# Altium schematic sheet schematic_usb_multirs232.schdoc
size 274 x 231 mm
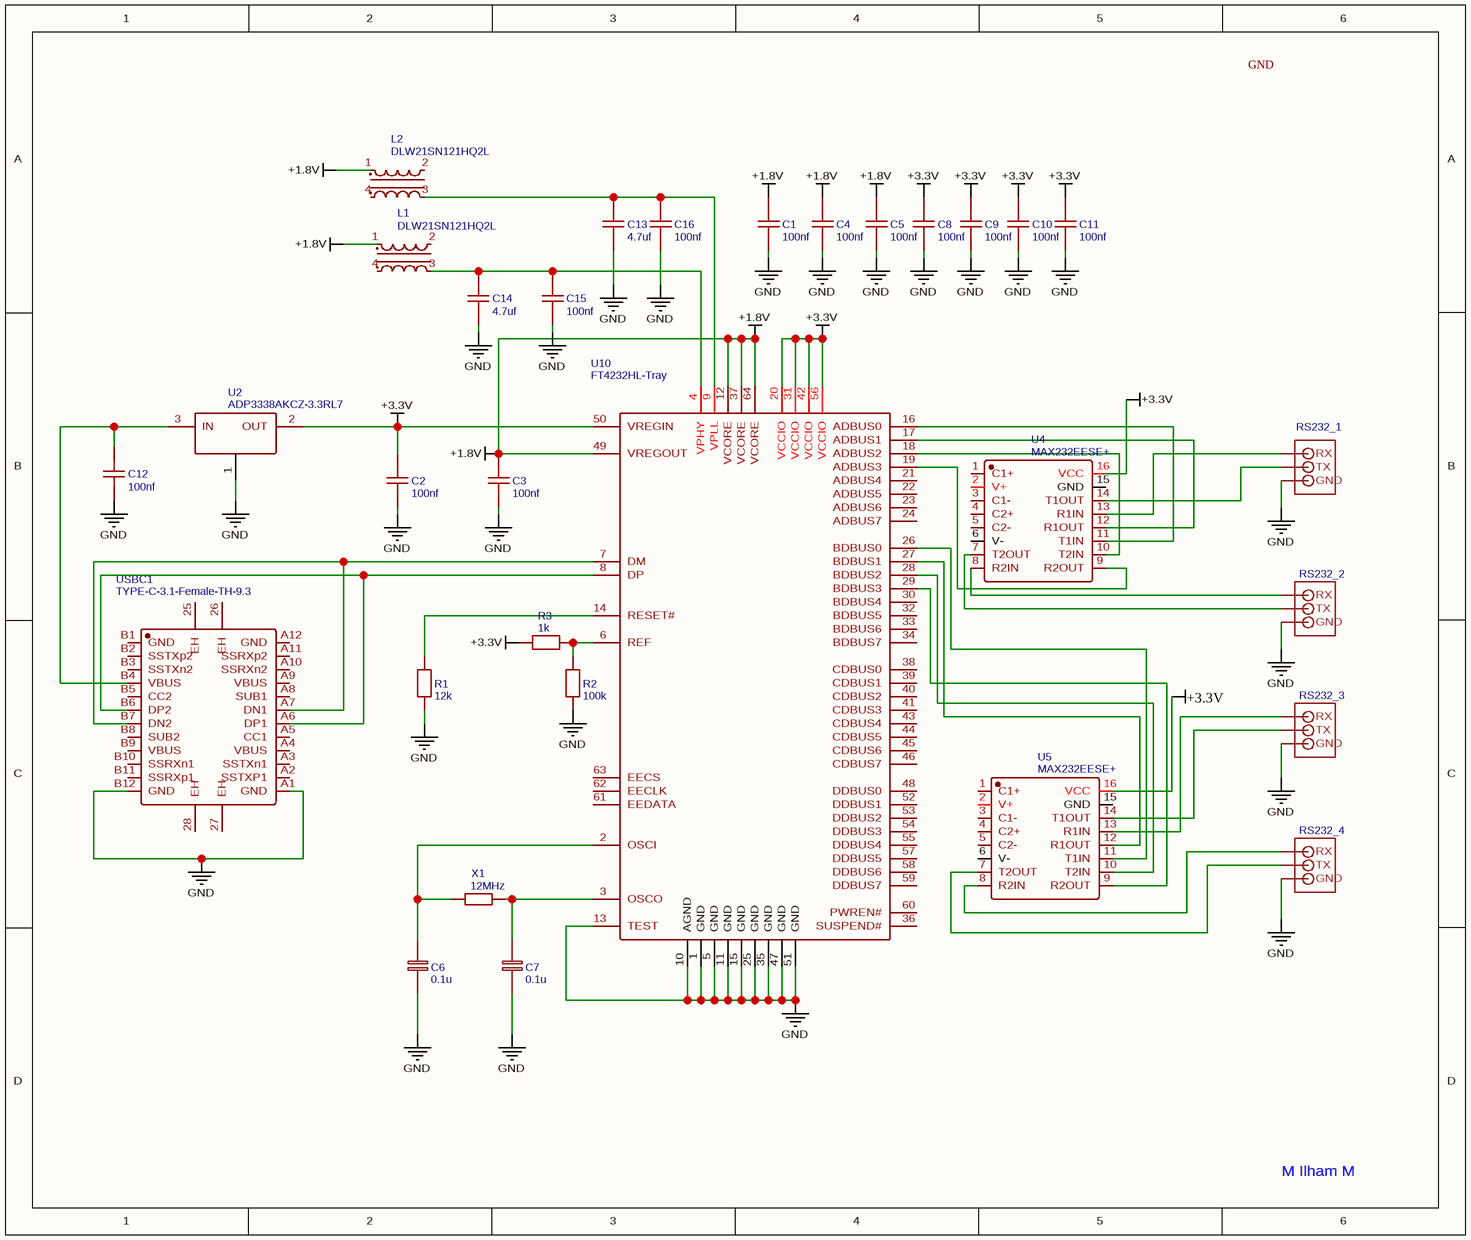
[diagram p0: schematic_usb_multirs232.schdoc]

## Parts
C1  100nf  [C0603]
C2  100nf  [C0603]
C3  100nf  [C0603]
C4  100nf  [C0603]
C5  100nf  [C0603]
C6  0.1u  [C0603]
C7  0.1u  [C0603]
C8  100nf  [C0603]
C9  100nf  [C0603]
C10  100nf  [C0603]
C11  100nf  [C0603]
C12  100nf  [C0603]
C13  4.7uf  [C0603]
C14  4.7uf  [C0603]
C15  100nf  [C0603]
C16  100nf  [C0603]
L1  DLW21SN121HQ2L  [FILTER-SMD_4P-L2.0-W1.2-BL_DLW21S]
L2  DLW21SN121HQ2L  [FILTER-SMD_4P-L2.0-W1.2-BL_DLW21S]
R1  12k  [R0603]
R2  100k  [R0603]
R3  1k  [R0603]
RS232_1  RX  [JST_B3B-PH_HEADER]  (value not drawn)
U2  ADP3338AKCZ-3.3RL7  [SOT-223]
U4  MAX232EESE+  [SO-16_L9.9-W3.9-P1.27-LS6.0-BL]
U5  MAX232EESE+  [SO-16_L9.9-W3.9-P1.27-LS6.0-BL]
U7  RS232_2  [JST_B3B-PH_HEADER]
U8  RS232_3  [JST_B3B-PH_HEADER]
U9  RS232_4  [JST_B3B-PH_HEADER]
U10  FT4232HL-Tray  [LQFP-64]
USBC1  TYPE-C-3.1-Female-TH-9.3  [USB-C-SMD_TYPE-C-3.1-FEMALE-TH-9.3]
X1  12MHz  [CRYSTAL-SMD_L11.1-W4.8-LS12.3]

## Nets
+1.8V: C1.1 C3.1 C4.1 C5.1 L1.1 L2.1 U5.16(VCC) U10.12(VCORE) U10.37(VCORE) U10.49(VREGOUT) U10.64(VCORE)
+3.3V: C2.1 C8.1 C9.1 C10.1 C11.1 R3.1 U2.2(OUT) U4.16(VCC) U10.20(VCCIO) U10.31(VCCIO) U10.42(VCCIO) U10.50(VREGIN) U10.56(VCCIO)
GND: C1.2 C2.2 C3.2 C4.2 C5.2 C6.2 C7.2 C8.2 C9.2 C10.2 C11.2 C12.2 C13.2 C14.2 C15.2 C16.2 R1.2 R2.2 RS232_1.P3(GND) U2.1(GND) U7.P3(GND) U8.P3(GND) U9.P3(GND) U10.1(GND) U10.5(GND) U10.10(AGND) U10.11(GND) U10.13(TEST) U10.15(GND) U10.25(GND) U10.35(GND) U10.47(GND) U10.51(GND) USBC1.A1(GND) USBC1.B12(GND)
NetC6_1: C6.1 U10.2(OSCI) X1.1
NetC7_1: C7.1 U10.3(OSCO) X1.2
NetC12_1: C12.1 U2.3(IN) USBC1.B4(VBUS)
NetC13_1: C13.1 C16.1 L2.3 U10.9(VPLL)
NetC14_1: C14.1 C15.1 L1.3 U10.4(VPHY)
NetR1_1: R1.1 U10.14(RESET#)
NetR2_1: R2.1 R3.2 U10.6(REF)
NetRS232_1_P1: RS232_1.P1(RX) U4.13(R1IN)
NetRS232_1_P2: RS232_1.P2(TX) U4.14(T1OUT)
NetU4_7: U4.7(T2OUT) U7.P2(TX)
NetU4_8: U4.8(R2IN) U7.P1(RX)
NetU4_9: U4.9(R2OUT) U10.19(ADBUS3)
NetU4_10: U4.10(T2IN) U10.18(ADBUS2)
NetU4_11: U4.11(T1IN) U10.16(ADBUS0)
NetU4_12: U4.12(R1OUT) U10.17(ADBUS1)
NetU5_7: U5.7(T2OUT) U9.P2(TX)
NetU5_8: U5.8(R2IN) U9.P1(RX)
NetU5_9: U5.9(R2OUT) U10.29(BDBUS3)
NetU5_10: U5.10(T2IN) U10.28(BDBUS2)
NetU5_11: U5.11(T1IN) U10.26(BDBUS0)
NetU5_12: U5.12(R1OUT) U10.27(BDBUS1)
NetU5_13: U5.13(R1IN) U8.P1(RX)
NetU5_14: U5.14(T1OUT) U8.P2(TX)
NetU10_7: U10.7(DM) USBC1.A7(DN1) USBC1.B7(DN2)
NetU10_8: U10.8(DP) USBC1.A6(DP1) USBC1.B6(DP2)

Not connected (* = marked no-connect by the designer): L1 2 4; L2 2 4; U4 1(C1+) 2(V+) 3(C1-) 4(C2+) 5(C2-) 6(V-) 15(GND); U5 1(C1+) 2(V+) 3(C1-) 4(C2+) 5(C2-) 6(V-) 15(GND); U10 21(ADBUS4) 22(ADBUS5) 23(ADBUS6) 24(ADBUS7) 30(BDBUS4) 32(BDBUS5) 33(BDBUS6) 34(BDBUS7) 36(SUSPEND#) 38(CDBUS0) 39(CDBUS1) 40(CDBUS2) 41(CDBUS3) 43(CDBUS4) 44(CDBUS5) 45(CDBUS6) 46(CDBUS7) 48(DDBUS0) 52(DDBUS1) 53(DDBUS2) 54(DDBUS3) 55(DDBUS4) 57(DDBUS5) 58(DDBUS6) 59(DDBUS7) 60(PWREN#) 61(EEDATA) 62(EECLK) 63(EECS); USBC1 25(EH) 26(EH) 27(EH) 28(EH) A2(SSTXP1) A3(SSTXn1) A4(VBUS) A5(CC1) A8(SUB1) A9(VBUS) A10(SSRXn2) A11(SSRXp2) A12(GND) B1(GND) B2(SSTXp2) B3(SSTXn2) B5(CC2) B8(SUB2) B9(VBUS) B10(SSRXn1) B11(SSRXp1)

## Notes on the sheet
- +3.3V
- M Ilham M

## Library data of the parts
C1-C5 C8-C12 C15 C16 = 100nf: nameAlias: Value(F); Contributor: LCEDA_Lib; spicePre: C; spiceSymbolName: C_0603_US
C6 C7 = 0.1u: nameAlias: Value(F); Contributor: LCEDA_Lib; spicePre: C; spiceSymbolName: C_0603_EU
C13 C14 = 4.7uf: nameAlias: Value(F); Contributor: LCEDA_Lib; spicePre: C; spiceSymbolName: C_0603_US
L1 L2 = DLW21SN121HQ2L: Manufacturer: muRata(村田); Contributor: LCSC; Supplier: LCSC; Supplier Part: C701154; Manufacturer Part: DLW21SN121HQ2L; JLCPCB Part Class: Extended Part; spicePre: L; spiceSymbolName: DLW21SN121HQ2L
R1 = 12k: nameAlias: Value(Ω); Contributor: LCEDA_Lib; spicePre: R; spiceSymbolName: R_0603_EU
R2 = 100k: nameAlias: Value(Ω); Contributor: LCEDA_Lib; spicePre: R; spiceSymbolName: R_0603_EU
R3 = 1k: nameAlias: Value(Ω); Contributor: LCEDA_Lib; spicePre: R; spiceSymbolName: R_0603_EU
U2 = ADP3338AKCZ-3.3RL7: description: High Accuracy, Ultralow IQ, 1 A, anyCAP(R) Low Dropout Regulator, 2.7 to 8 V Vin, 3.3 V Vout, Industrial, 3-pin SOT223 (KC-3), Reel; spicePre: U; spiceSymbolName: ADP3338AKCZ-3.3RL7
U4 U5 = MAX232EESE+: Manufacturer: ADI(亚德诺)/MAXIM(美信); Contributor: lcsc; Supplier: LCSC; Supplier Part: C1543819; Manufacturer Part: MAX232EESE+; JLCPCB Part Class: Extended Part; spicePre: U; spiceSymbolName: MAX232EESE+
U10 = FT4232HL-Tray: description: Quad High Speed USB To Multipurpose UARTMPSSE IC, 64-pin LQFP, Tray; spicePre: U; spiceSymbolName: FT4232HL-Tray
USBC1 = TYPE-C-3.1-Female-TH-9.3: Manufacturer: 精拓金; Manufacturer Part: 918-418K2022Y40004; Contributor: LCSC; Supplier: LCSC; Supplier Part: C168703; JLCPCB Part Class: Extended Part; spicePre: U; spiceSymbolName: TYPE-C-3.1-Female-TH-9.3
X1 = 12MHz: Manufacturer: CTS(西迪斯); Manufacturer Part: ATS240CSM-1E; Contributor: LCSC; nameAlias: Value; Supplier: LCSC; Supplier Part: C1985692; JLCPCB Part Class: Extended Part; spicePre: X; spiceSymbolName: ATS240CSM-1E
RS232_1 = RX: spicePre: U; spiceSymbolName: JST-PH_3-PIN_HEADER
U7 = RS232_2: spicePre: U; spiceSymbolName: JST-PH_3-PIN_HEADER
U8 = RS232_3: spicePre: U; spiceSymbolName: JST-PH_3-PIN_HEADER
U9 = RS232_4: spicePre: U; spiceSymbolName: JST-PH_3-PIN_HEADER